# Altium schematic sheet POWER_SUPPLY.SchDoc
size A
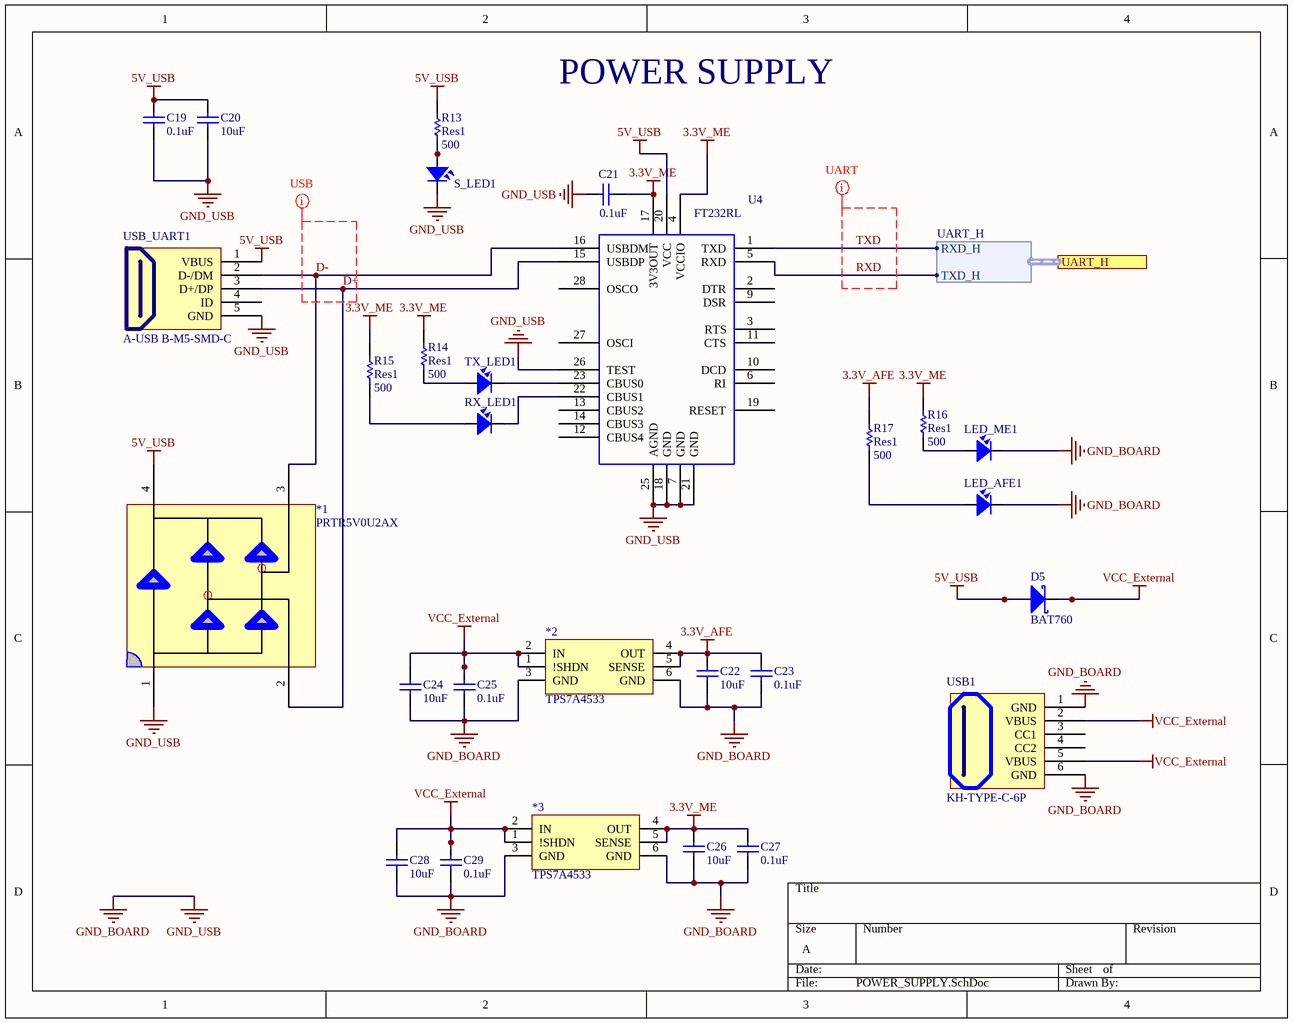
[diagram p0: POWER_SUPPLY.SchDoc]

## Parts
*1  PRTR5V0U2AX  [PRTR5V0U2AX]
*2  TPS7A4533  [SOT127P706X180-6N]
*3  TPS7A4533  [SOT127P706X180-6N]
C19  value 0.1uF  [RES-SMD-0603]  (hidden comment: Cap)
C20  value 10uF  [RES-SMD-0603]  (hidden comment: Cap)
C21  value 0.1uF  [RES-SMD-0603]  (hidden comment: Cap)
C22  value 10uF  [RES-SMD-0603]  (hidden comment: Cap)
C23  value 0.1uF  [RES-SMD-0603]  (hidden comment: Cap)
C24  value 10uF  [RES-SMD-0603]  (hidden comment: Cap)
C25  value 0.1uF  [RES-SMD-0603]  (hidden comment: Cap)
C26  value 10uF  [RES-SMD-0603]  (hidden comment: Cap)
C27  value 0.1uF  [RES-SMD-0603]  (hidden comment: Cap)
C28  value 10uF  [RES-SMD-0603]  (hidden comment: Cap)
C29  value 0.1uF  [RES-SMD-0603]  (hidden comment: Cap)
D5  BAT760  [SOD323(F)]
LED_AFE1  LED  [RES-SMD-0805]  (value not drawn)
LED_ME1  LED  [RES-SMD-0805]  (value not drawn)
R13  Res1  value 500  [RES-SMD-0603]
R14  Res1  value 500  [RES-SMD-0603]
R15  Res1  value 500  [RES-SMD-0603]
R16  Res1  value 500  [RES-SMD-0603]
R17  Res1  value 500  [RES-SMD-0603]
RX_LED1  LED  [RES-SMD-0805]  (value not drawn)
S_LED1  LED  [RES-SMD-0805]  (value not drawn)
TX_LED1  LED  [RES-SMD-0805]  (value not drawn)
U4  FT232RL  [TSSOP28]
USB1  KH-TYPE-C-6P  [USB-typeC-6pin]
USB_UART1  A-USB B-M5-SMD-C  [USB_B_MINI_SMD]

## Ports
UART_H (harness UART_H)

## Harnesses
UART_H: RXD_H, TXD_H

## Nets
3.3V_AFE: *2.4(OUT) *2.5(SENSE) C22.2 C23.2 R17.2
3.3V_ME: *3.4(OUT) *3.5(SENSE) C21.2 C26.2 C27.2 R14.2 R15.2 R16.2 U4.4(VCCIO) U4.17(3V3OUT)
5V_USB: *1.4 C19.2 C20.1 D5.1(A) R13.2 U4.20(VCC) USB_UART1.1(VBUS)
GND_BOARD: *1.1 *2.3(GND) *2.6(GND) *3.3(GND) *3.6(GND) C19.1 C20.2 C21.1 C22.1 C23.1 C24.1 C25.1 C26.1 C27.1 C28.1 C29.1 LED_AFE1.2 LED_ME1.2 S_LED1.2 U4.7(GND) U4.18(GND) U4.21(GND) U4.25(AGND) U4.26(TEST) USB1.1(GND) USB1.6(GND) USB_UART1.5(GND)  [also labelled GND_USB]
VCC_External: *2.1(!SHDN) *2.2(IN) *3.1(!SHDN) *3.2(IN) C24.2 C25.2 C28.2 C29.2 D5.2(K) USB1.2(VBUS) USB1.5(VBUS)
D+: *1.2 U4.15(USBDP) USB_UART1.3(D+/DP)
D-: *1.3 U4.16(USBDM) USB_UART1.2(D-/DM)
RXD: U4.5(RXD) ; port UART_H.TXD_H
TXD: U4.1(TXD) ; port UART_H.RXD_H
NetLED_AFE1_1: LED_AFE1.1 R17.1
NetLED_ME1_1: LED_ME1.1 R16.1
NetR13_1: R13.1 S_LED1.1
NetR14_1: R14.1 TX_LED1.1
NetR15_1: R15.1 RX_LED1.1
NetRX_LED1_2: RX_LED1.2 U4.22(CBUS1)
NetTX_LED1_2: TX_LED1.2 U4.23(CBUS0)

Not connected (* = marked no-connect by the designer): U4 2(DTR) 3(RTS) 6(RI) 9(DSR) 10(DCD) 11(CTS) 12(CBUS4) 13(CBUS2) 14(CBUS3) 19(RESET) 27(OSCI) 28(OSCO); USB1 3(CC1) 4(CC2); USB_UART1 4(ID)

## Layout directives
mark named USB: D+, D-
mark named UART: RXD, TXD

## Notes on the sheet
- POWER SUPPLY

## Library data of the parts
*2 *3 = TPS7A4501
C19-C29 = Cap: Capacitor; Published: 8-Jun-2000; LatestRevisionDate: 17-Jul-2002; LatestRevisionNote: Re-released for DXP Platform.; PackageReference: RAD-0.3; Publisher: Altium Limited; PackageDescription: Radial Cap, Thru-Hole; 2 Leads; 0.3 in Pin Spacing
D5 = D Schottky: Schottky Diode; Published: 8-Jun-2000; LatestRevisionDate: 17-Jul-2002; LatestRevisionNote: Re-released for DXP Platform.; PackageReference: SMB; Publisher: Altium Limited; PackageDescription: DO-214-AA/SMB; 2 C-Bend Leads; Body 5.3 x 3.6 mm, inc. leads (LxW); Code_JEDEC: DO-214-AA
LED_AFE1 LED_ME1 RX_LED1 S_LED1 TX_LED1 = LED SMD: Value: LED 3 - 5 ly 2 Colour
R13-R17 = Res1: Resistor; Published: 8-Jun-2000; LatestRevisionDate: 17-Jul-2002; LatestRevisionNote: Re-released for DXP Platform.; PackageReference: AXIAL-0.3; Publisher: Altium Limited; PackageDescription: Axial Device, Thru-Hole; 2 Leads; 0.3 in Pin Spacing
U4 = FT232RL: USB TO UART INTERFACE; Manufacturer: FTDI, Future Technology Devices International Ltd; Manufacturer Part Number: FT232RL R; Number of Channels: 8; Voltage: 3.3 V ~ 5.25 V; FIFO's: 256 Byte; Supplier 1: Digi-Key; Supplier Part Number 1: 768-1007-2-ND; RoHS: RoHS Compliant; Features: Serial Interface; Package / Case: 28-SSOP; Supplier: Digi-Key; Packaging: Tape & Reel (TR); Supplier Part Number: 768-1007-2-ND; Category: Integrated Circuits (ICs)
USB1 = USB-typeC
USB_UART1 = USB_M